# Altium schematic sheet Titan_VCO.SchDoc
size A4
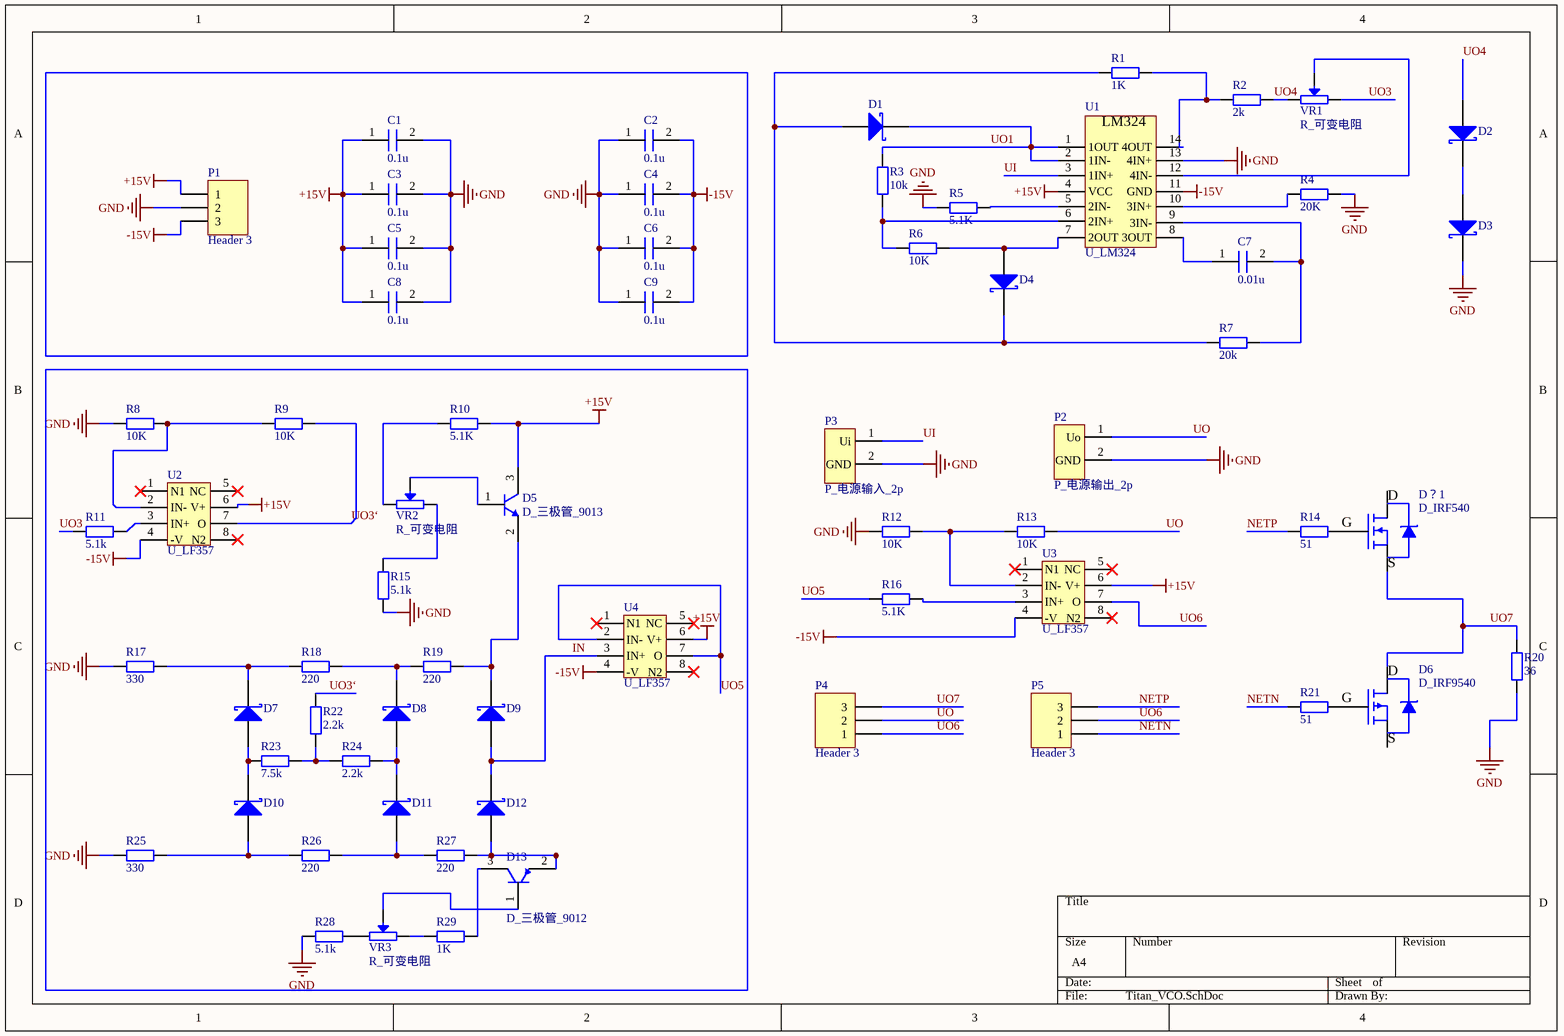
[diagram p0: Titan_VCO.SchDoc]

## Parts
C1  0.1u  [C 0805_M]
C2  0.1u  [C 0805_M]
C3  0.1u  [C 0805_M]
C4  0.1u  [C 0805_M]
C5  0.1u  [C 0805_M]
C6  0.1u  [C 0805_M]
C7  0.01u  [C 0805_M]
C8  0.1u  [C 0805_M]
C9  0.1u  [C 0805_M]
D1  D_肖特基管_稳压管  [TO-220AC]  (value not drawn)
D2  D_肖特基管_稳压管  [TO-220AC]  (value not drawn)
D3  D_肖特基管_稳压管  [TO-220AC]  (value not drawn)
D4  D_肖特基管_稳压管  [TO-220AC]  (value not drawn)
D5  D_三极管_9013  [D_三极管_9013]
D6  D_IRF9540  [D_IRF9540]
D7  D_肖特基管_稳压管  [TO-220AC]  (value not drawn)
D8  D_肖特基管_稳压管  [TO-220AC]  (value not drawn)
D9  D_肖特基管_稳压管  [TO-220AC]  (value not drawn)
D10  D_肖特基管_稳压管  [TO-220AC]  (value not drawn)
D11  D_肖特基管_稳压管  [TO-220AC]  (value not drawn)
D12  D_肖特基管_稳压管  [TO-220AC]  (value not drawn)
D13  D_三极管_9012  [D_三极管_9012]
D？1  D_IRF540  [D_IRF540]
P1  Header 3  [P_电源输入端子_三端口_复用]
P2  P_电源输出_2p  [P_电源输入端子_二端口_复用]
P3  P_电源输入_2p  [P_电源输入端子_二端口_复用]
P4  Header 3  [HDR1X3]
P5  Header 3  [HDR1X3]
R1  1K  [R 0805_M]
R2  2k  [R 0805_M]
R3  10k  [R 0805_M]
R4  20K  [R 0805_M]
R5  5.1K  [R 0805_M]
R6  10K  [R 0805_M]
R7  20k  [R 0805_M]
R8  10K  [R 0805_M]
R9  10K  [R 0805_M]
R10  5.1K  [R 0805_M]
R11  5.1k  [R 0805_M]
R12  10K  [R 0805_M]
R13  10K  [R 0805_M]
R14  51  [R 0805_M]
R15  5.1k  [R 0805_M]
R16  5.1K  [R 0805_M]
R17  330  [R 0805_M]
R18  220  [R 0805_M]
R19  220  [R 0805_M]
R20  36  [R 0805_M]
R21  51  [R 0805_M]
R22  2.2k  [R 0805_M]
R23  7.5k  [R 0805_M]
R24  2.2k  [R 0805_M]
R25  330  [R 0805_M]
R26  220  [R 0805_M]
R27  220  [R 0805_M]
R28  5.1k  [R 0805_M]
R29  1K  [R 0805_M]
U1  U_LM324  [U_LM324]
U2  U_LF357  [P_DIP-8_L9.7-W6.4-P2.54-LS7.6-BL]
U3  U_LF357  [P_DIP-8_L9.7-W6.4-P2.54-LS7.6-BL]
U4  U_LF357  [P_DIP-8_L9.7-W6.4-P2.54-LS7.6-BL]
VR1  R_可变电阻  [R_微调卧式蓝白电位器]
VR2  R_可变电阻  [R_微调卧式蓝白电位器]
VR3  R_可变电阻  [R_微调卧式蓝白电位器]

## Nets
+15V: C1.1 C3.1 C5.1 C8.1 D5.3(c) P1.1 R10.2 U1.4(VCC) U2.6(V+) U3.6(V+) U4.6(V+)
-15V: C2.2 C4.2 C6.2 C9.2 P1.3 U1.11(GND) U2.4(-V) U3.4(-V) U4.4(-V)
GND: C1.2 C2.1 C3.2 C4.1 C5.2 C6.1 C8.2 C9.1 D3.1(K) P1.2 P2.2(GND) P3.2(GND) R4.1 R5.2 R8.1 R12.2 R15.1 R17.1 R20.2 R25.1 R28.1 U1.13(4IN+)
IN: D9.3(A) D12.1(K) U4.3(IN+)
NETN: P5.1 R21.2
NETP: P5.3 R14.2
UI: P3.1(Ui) U1.3(1IN+)
UO: P2.1(Uo) P4.2 R13.1
UO1: D1.1(K) R3.2 U1.1(1OUT) U1.2(1IN-)
UO3: R11.1 VR1.3
UO3‘: R9.2 R22.2 U2.7(O)
UO4: D2.3(A) R2.1 VR1.1
UO5: R16.2 U4.2(IN-) U4.7(O)
UO6: P4.1 P5.2 U3.7(O)
UO7: D6.2(D) D？1.3(S) P4.3 R20.1
NetC7_1: C7.1 U1.8(3OUT)
NetC7_2: C7.2 R7.1 U1.9(3IN-)
NetD1_3: D1.3(A) D4.1(K) R1.2 R7.2
NetD2_1: D2.1(K) D3.3(A)
NetD4_3: D4.3(A) R6.1 U1.7(2OUT)
NetD5_1: D5.1(b) VR2.2
NetD5_2: D5.2(e) D9.1(K) R19.2
NetD6_1: D6.1(G) R21.1
NetD7_1: D7.1(K) R17.2 R18.1
NetD7_3: D7.3(A) D10.1(K) R23.2
NetD8_1: D8.1(K) R18.2 R19.1
NetD8_3: D8.3(A) D11.1(K) R24.2
NetD10_3: D10.3(A) R25.2 R26.1
NetD11_3: D11.3(A) R26.2 R27.1
NetD12_3: D12.3(A) D13.2(e) R27.2
NetD13_1: D13.1(b) VR3.2
NetD13_3: D13.3(c) R29.2
NetD？1_1: D？1.1(G) R14.1
NetR1_1: R1.1 R2.2 U1.14(4OUT)
NetR3_1: R3.1 R6.2 U1.6(2IN+)
NetR4_2: R4.2 U1.10(3IN+)
NetR5_1: R5.1 U1.5(2IN-)
NetR8_2: R8.2 R9.1 U2.2(IN-)
NetR10_1: R10.1 VR2.1
NetR11_2: R11.2 U2.3(IN+)
NetR12_1: R12.1 R13.2 U3.2(IN-)
NetR15_2: R15.2 VR2.3
NetR16_1: R16.1 U3.3(IN+)
NetR22_1: R22.1 R23.1 R24.1
NetR28_2: R28.2 VR3.1
NetR29_1: R29.1 VR3.3
NetU1_12: U1.12(4IN-) VR1.2

Not connected (* = marked no-connect by the designer): D6 3(S); D？1 2(D); U2 1(N1)* 5(NC)* 8(N2)*; U3 1(N1)* 5(NC)* 8(N2)*; U4 1(N1)* 5(NC)* 8(N2)*

## Notes on the sheet
- (in symbol U_LM324) LM324

## Library data of the parts
C1-C9 = C
D1-D4 D7-D12 = D_肖特基管_稳压管: Schottky Rectifier; Note: Terminal 2 is the TAB and is electrically connected to the cathode; Published: 8-Jun-2000; LatestRevisionDate: 17-Jul-2002; LatestRevisionNote: Re-released for DXP Platform.; DatasheetVersion: PD-2.057B; PackageVersion: Feb-1998; PackageReference: TO-220AC; Publisher: Altium Limited; PackageDescription: TO, Thru-Hole, Vertical, Heatsink Mounted; 3 In-Line Leads (1 Absent); Pitch 2.54 mm; ComponentLink1Description: Manufacturer Link; ComponentLink1URL: http://www.irf.com/; ComponentLink2Description: Datasheet; ComponentLink2URL: http://www.irf.com/product-info/datasheets/data/10tq.pdf
D5 = D_三极管_9012
P1 P4 P5 = Header 3: Header, 3-Pin; LatestRevisionDate: 17-Jul-2002; LatestRevisionNote: Re-released for DXP Platform.; Publisher: Altium Limited
R1-R29 = R1: 贴片电阻; 版权归属: 黎明电子style; BOM名称: 贴片电阻; 学习资源: https://lmdzstyle.taobao.com/